# EAGLE design v02 (EAGLE 6.6.0)
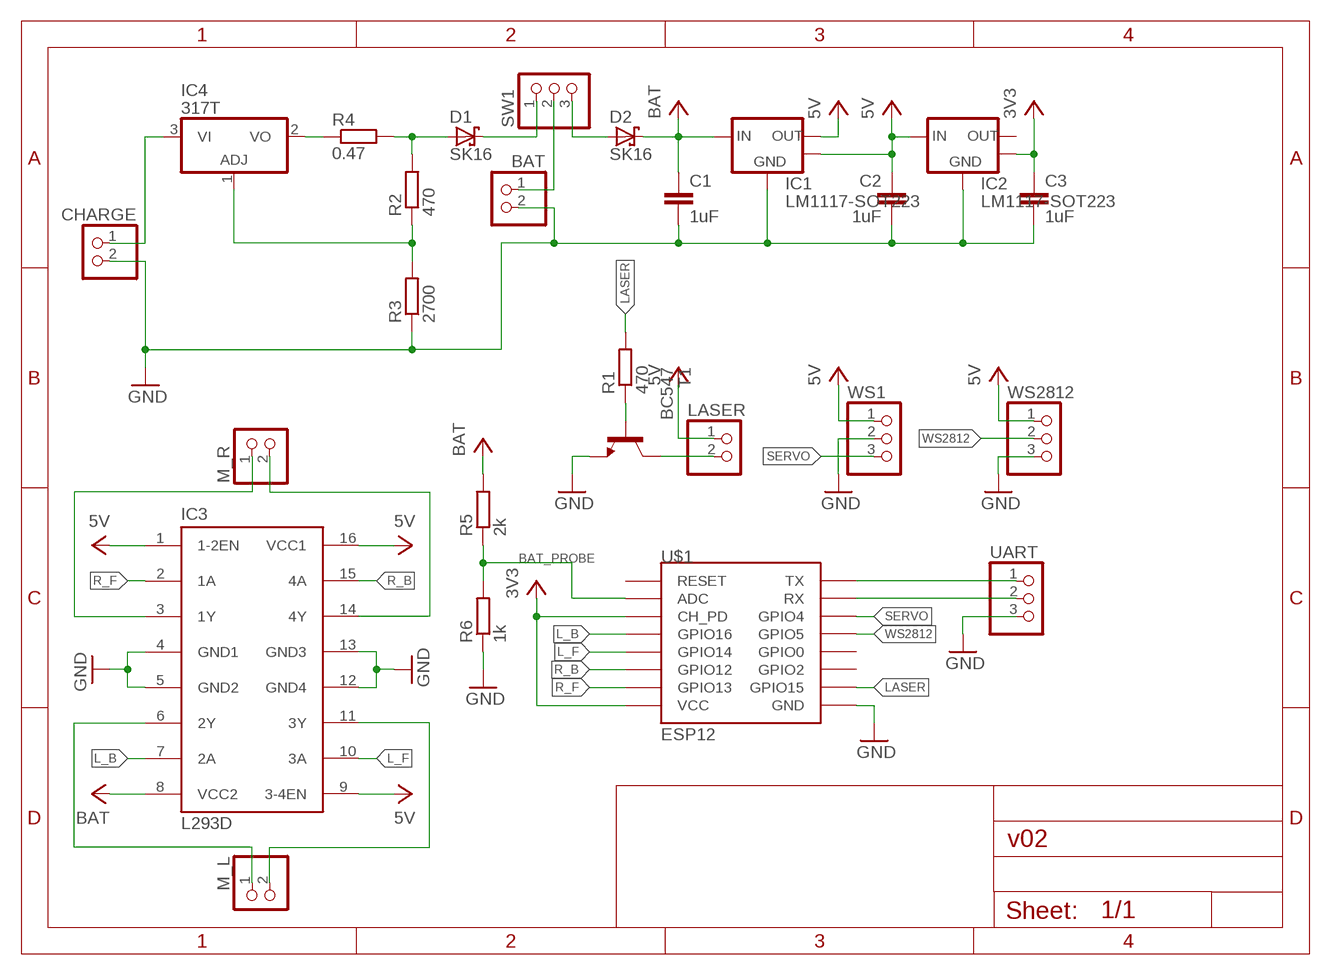
[diagram p0: schematic, sheet 1]

## Parts
BAT  PINHD-1X2  [1X02]
C1  1uF  C-EUC0805  [C0805]
C2  1uF  C-EUC0805  [C0805]
C3  1uF  C-EUC0805  [C0805]
CHARGE  PINHD-1X2  [1X02]
D1  SK16  SCHOTTKY-DIODESMD  [SMB]
D2  SK16  SCHOTTKY-DIODESMD  [SMB]
IC1  LM1117-SOT223  [SOT-223-3]
IC2  LM1117-SOT223  [SOT-223-3]
IC3  L293D  [DIL16]
IC4  317T  [TO220H]
LASER  PINHD-1X2  [1X02]
M_L  PINHD-1X2  [1X02]
M_R  PINHD-1X2  [1X02]
R1  470  R-EU_R0805  [R0805]
R2  470  R-EU_R0805  [R0805]
R3  2700  R-EU_R0805  [R0805]
R4  0.47  R-EU_MELF0207W  [MINI_MELF-0207W]
R5  2k  R-EU_R0805  [R0805]
R6  1k  R-EU_R0805  [R0805]
SW1  PINHD-1X3  [1X03]
T1  BC547  [TO92]
U$1  ESP12  [ESP12]
UART  PINHD-1X3  [1X03]
WS1  PINHD-1X3  [1X03]
WS2812  PINHD-1X3  [1X03]

## Nets
3V3: C3.1 IC2.4(HEATSINK) U$1.CH_PD U$1.VCC
5V: C2.1 IC1.4(HEATSINK) IC2.3(VIN) LASER.1 WS1.1 WS2812.1
5V_2: IC1.2(VOUT) IC3.1(1-2EN) IC3.9(3-4EN) IC3.16(VCC1) ; supply symbol labelled 5V
BAT: C1.1 D2.C IC1.3(VIN) IC3.8(VCC2) R5.2
BAT_PROBE: R5.1 R6.2 U$1.ADC
GND: BAT.2 C1.2 C2.2 C3.2 CHARGE.2 IC1.1(GND) IC2.1(GND) IC3.4(GND1) IC3.5(GND2) IC3.12(GND4) IC3.13(GND3) R3.1 R6.1 T1.1(E) U$1.GND UART.3 WS1.2 WS2812.3
L_B: IC3.7(2A) U$1.GPIO16
L_F: IC3.10(3A) U$1.GPIO14
LASER: R1.2 U$1.GPIO15
N$1: BAT.1 SW1.2
N$2: R1.1 T1.2(B)
N$3: CHARGE.1 IC4.3(VI)
N$4: D1.C SW1.1
N$5: IC3.3(1Y) M_R.1
N$6: IC3.14(4Y) M_R.2
N$7: IC3.6(2Y) M_L.1
N$8: IC3.11(3Y) M_L.2
N$9: U$1.TX UART.1
N$10: U$1.RX UART.2
N$11: LASER.2 T1.3(C)
N$12: D1.A R2.2 R4.2
N$13: IC4.1(ADJ) R2.1 R3.2
N$14: IC4.2(VO) R4.1
N$15: D2.A SW1.3
R_B: IC3.15(4A) U$1.GPIO12
R_F: IC3.2(1A) U$1.GPIO13
SERVO: U$1.GPIO4 WS1.3
WS2812: U$1.GPIO5 WS2812.2
Unconnected: IC2.2(VOUT) U$1.GPIO0 U$1.GPIO2 U$1.RESET

## Library data of the parts
BAT CHARGE LASER M_L M_R = pinhead:PINHD-1X2: PIN HEADER
C1-C3 = rcl:C-EU: CAPACITOR, European symbol
D1 D2 = diode:SCHOTTKY-DIODE: Schottky Diode
IC1 IC2 = voltage_regulator:LM1117: LDO Voltage Regulator NCP1117 series are low dropout positive voltage regulators that are capable of providing an output current that is in excess of 1.0 A with a maximum dropout voltage of 1.2 V at 800 mA over temperature. This series contains nine fixed output voltages of 1.5 V, 1.8 V, 1.9 V, 2.0 V, 2.5 V, 2.85 V, 3.3 V, 5.0 V, and 12 V that have no minimum load requirement to maintain regulation. Also included is an adjustable output version that can be programmed from 1.25 V to 18.8 V with two external resistors. datasheet.pdf <http://www.onsemi.com/pub_link/Collateral/NCP1117-D.PDF> LM1117-N is a series of low dropout voltage regulators of 1.2V at 800mA of load current. It has the same pin-out as Texas Instruments' industry standard LM317. The LM1117-N is available in an adjustable version, available in five fixed voltages, 1.8V, 2.5V, 2.85V, 3.3V, and 5V. The LM1117-N offers current limiting and thermal shutdown. Its circuit includes a zener trimmed to within ±1%. datasheet.pdf <http://www.ti.com/lit/ds/symlink/lm1117-n.pdf>
IC3 = st-microelectronics:L293D: PUSH-PULL 4 CHANNEL DRIVER; MPN: L293D; OC_FARNELL: 9589619; OC_NEWARK: 56P8249
IC4 = linear:*317: Positive VOLTAGE REGULATOR
R1-R3 R5 R6 = rcl:R-EU_: RESISTOR, European symbol
R4 = resistor:R-EU_: RESISTOR, European symbol
SW1 UART WS1 WS2812 = pinhead:PINHD-1X3: PIN HEADER
T1 = transistor:BC547: NPN TRANSISTOR
U$1 = esp8266modules:ESP12: ESP8266 Wifi module 12

## Board
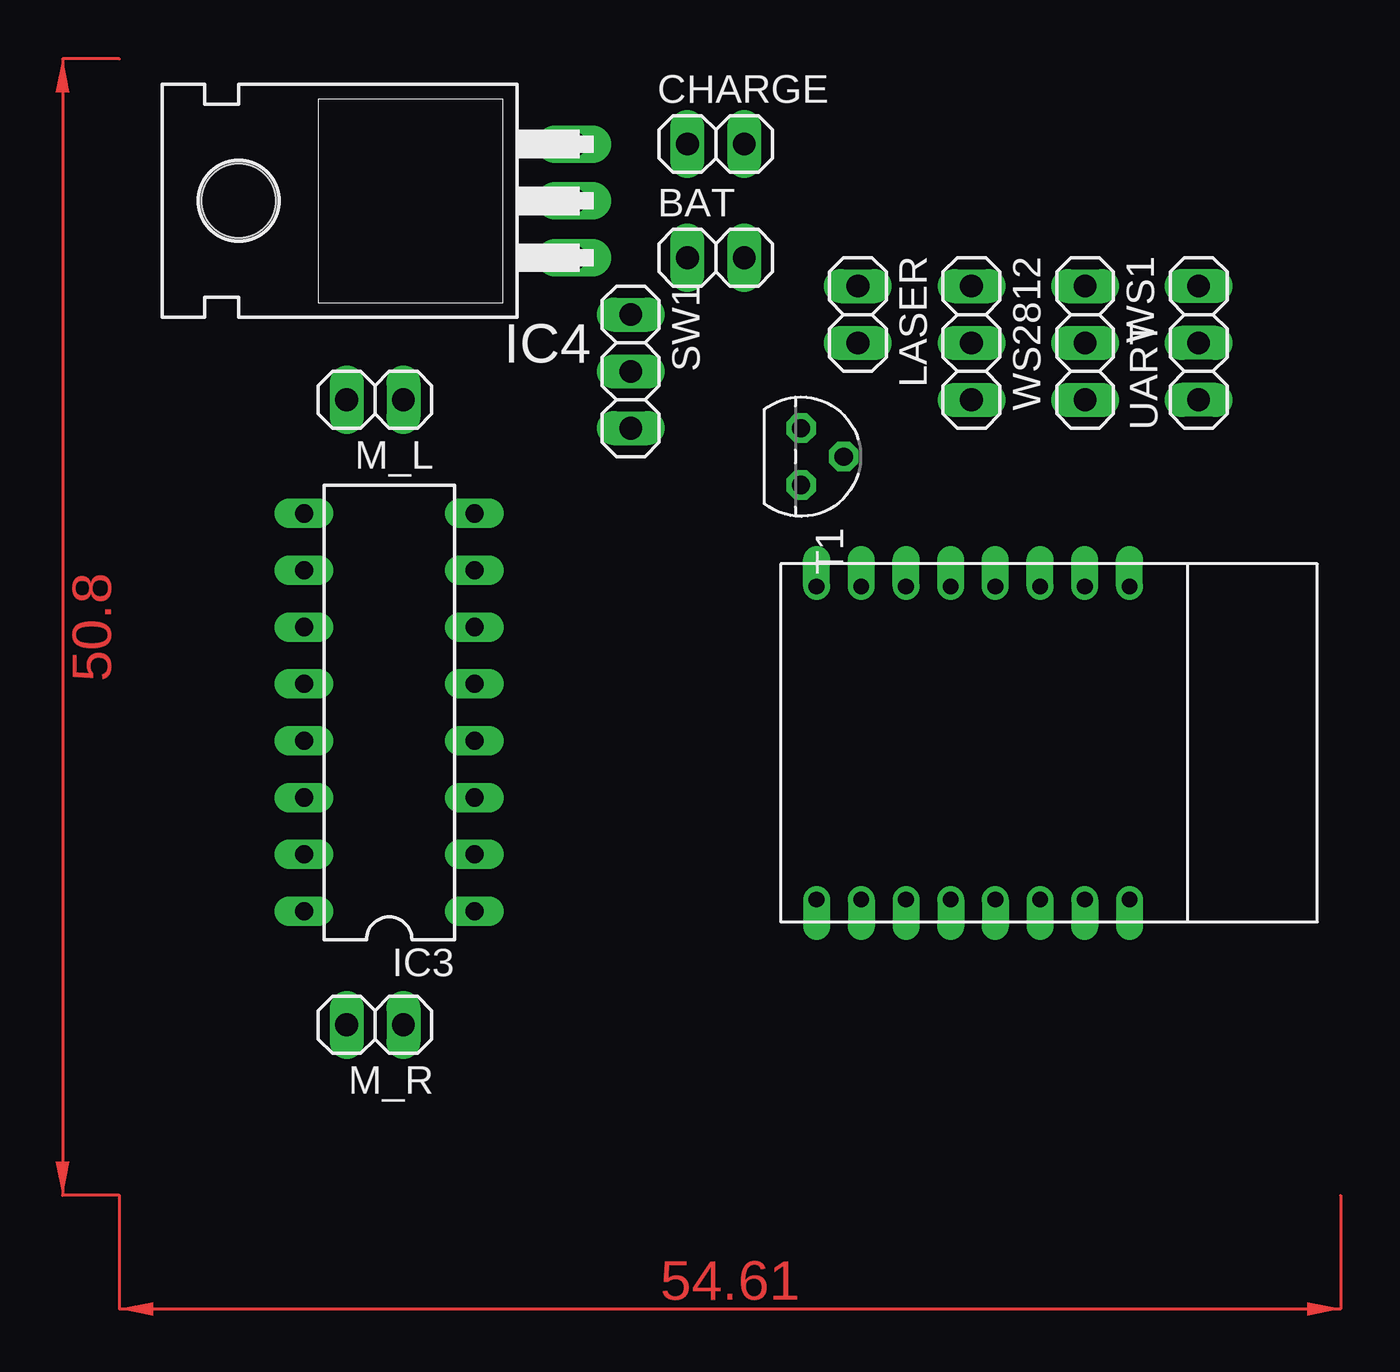
[diagram p1: board, top side]
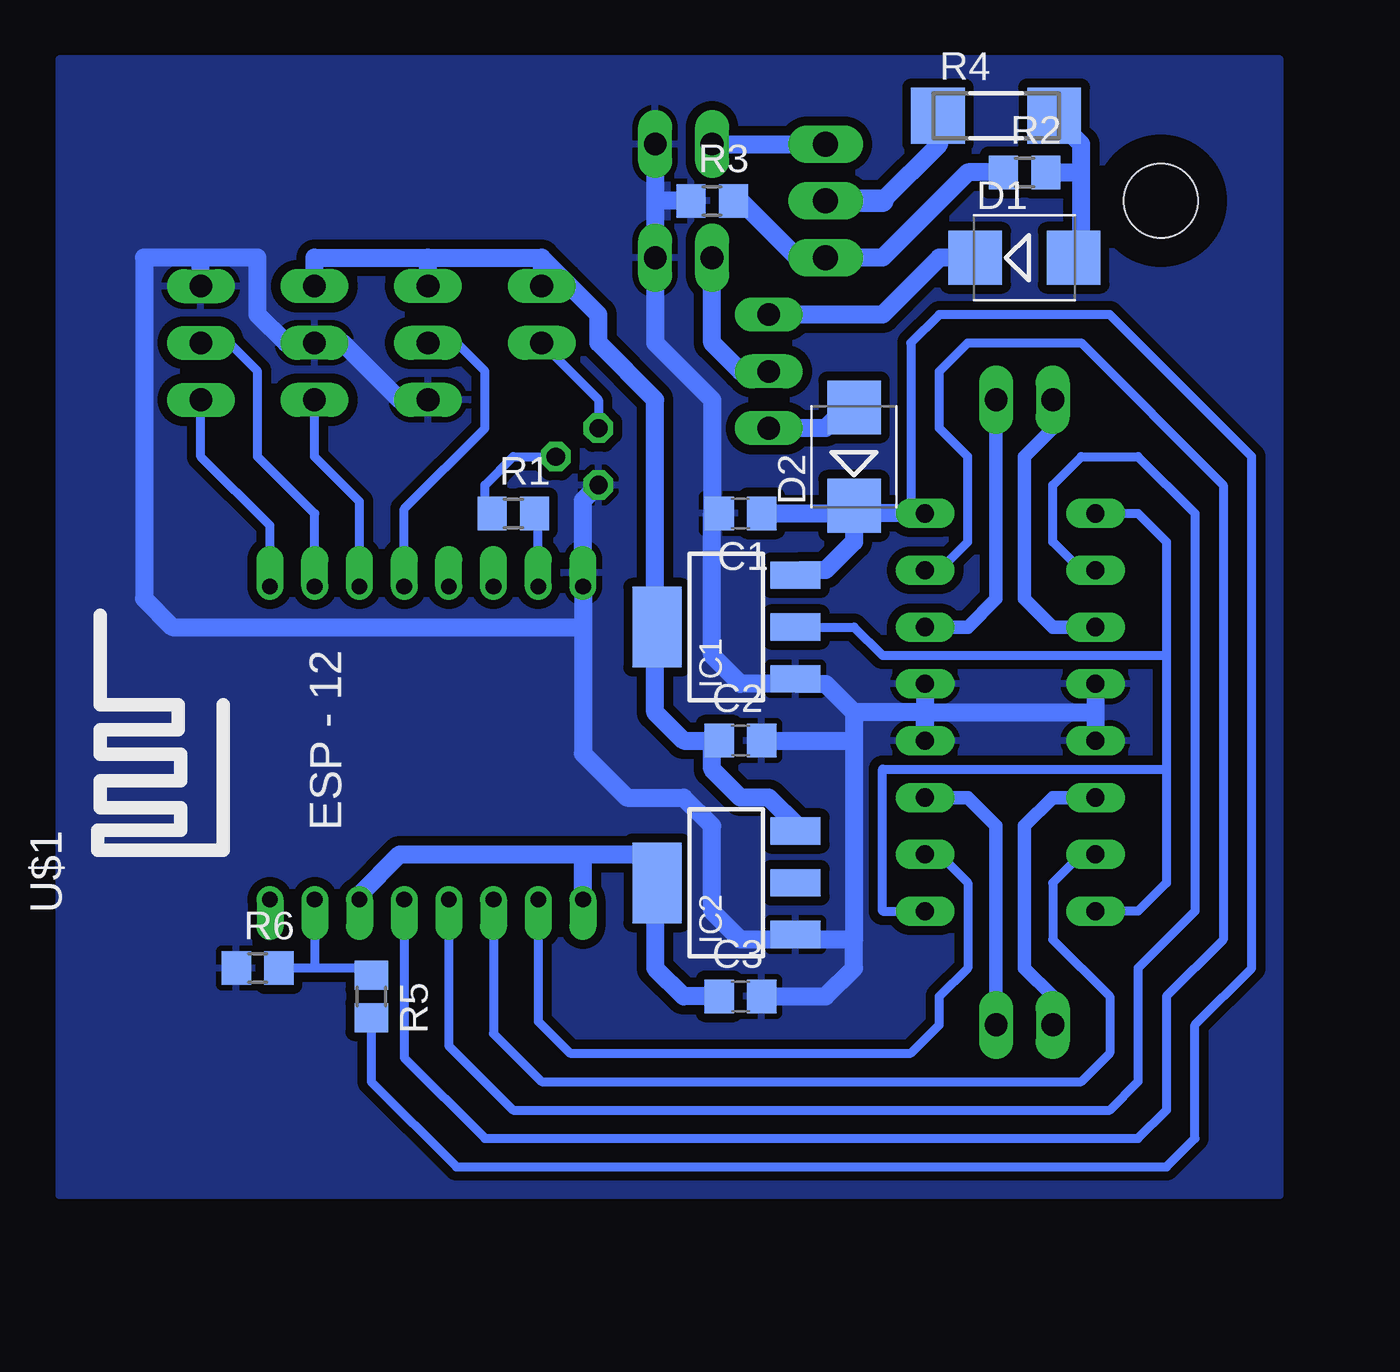
[diagram p2: board, bottom side, seen from below]

No outline drawn. Coordinates in mm, seen from the top.
Copper layers (1*16): Top 0.035mm / dielectric 1.5mm / Bottom 0.035mm
Design rules "default": minimum track width 10mil, minimum drill 24mil, track to track 8mil, track to pad 8mil, pad to pad 8mil, via to via 8mil, smd to smd 8mil, copper to edge 40mil, drill to drill 8mil, minimum pad ring 10mil, minimum via ring 8mil, stop-mask expansion 4mil, vias tented up to drill 0mil, thermal gap 10mil

### Footprints (pad centres in the part's own frame; a part is rotated, then mirrored left to right if it is on the bottom)
1X02 = drill 1.016 long: 1 -1.27,0; 2 1.27,0
C0805 = smd 1.3 x 1.5: 1 -0.95,0; 2 0.95,0
SMB = smd 2.4 x 2.4: A 2.2,0; C -2.2,0
SOT-223-3 = smd 1.219 x 2.235: 1 -2.311,-3.099; 2 0,-3.099; 3 2.311,-3.099 | smd 3.6 x 2.2: 4 0,3.099
DIL16 = drill 0.813 long: 1 -8.89,-3.81; 2 -6.35,-3.81; 3 -3.81,-3.81; 4 -1.27,-3.81; 5 1.27,-3.81; 6 3.81,-3.81; 7 6.35,-3.81; 8 8.89,-3.81; 9 8.89,3.81; 10 6.35,3.81; 11 3.81,3.81; 12 1.27,3.81; 13 -1.27,3.81; 14 -3.81,3.81; 15 -6.35,3.81; 16 -8.89,3.81
TO220H = drill 1.118 long: 1 -2.54,-10.16; 2 0,-10.16; 3 2.54,-10.16 | hole 3.302: 0,4.826
R0805 = smd 1.3 x 1.5: 1 -0.95,0; 2 0.95,0
MINI_MELF-0207W = smd 2.4 x 2.5: 1 -2.6,0; 2 2.6,0
1X03 = drill 1.016 long: 1 -2.54,0; 2 0,0; 3 2.54,0
TO92 = drill 0.813 octagon: 1 1.27,0; 2 0,1.905; 3 -1.27,0
ESP12 = drill 0.7 offset: ADC -7.1,3.8; CH_PD -7.1,1.8; GND 6.9,-8.2; GPIO0 6.9,-2.2; GPIO2 6.9,-4.2; GPIO4 6.9,1.8; GPIO5 6.9,-0.2; GPIO12 -7.1,-4.2; GPIO13 -7.1,-6.2; GPIO14 -7.1,-2.2; GPIO15 6.9,-6.2; GPIO16 -7.1,-0.2; RESET -7.1,5.8; RX 6.9,3.8; TX 6.9,5.8; VCC -7.1,-8.2

### Placement (x,y rotation side)
BAT  26.67,41.91 0 top
C1  24.13,30.48 180 bottom
C2  24.13,20.32 0 bottom
C3  24.13,8.89 0 bottom
CHARGE  26.67,46.99 0 top
D1  11.43,41.91 0 bottom
D2  19.05,33.02 90 bottom
IC1  24.77,25.4 90 bottom
IC2  24.77,13.97 90 bottom
IC3  12.06,21.59 90 top
IC4  10.16,44.45 90 top
LASER  33.02,39.37 270 top
M_L  11.43,35.56 180 top
M_R  11.43,7.62 180 top
R1  34.29,30.48 0 bottom
R2  11.43,45.72 0 bottom
R3  25.4,44.45 0 bottom
R4  12.7,48.26 0 bottom
R5  40.64,8.89 270 bottom
R6  45.72,10.16 0 bottom
SW1  22.86,36.83 270 top
T1  30.48,33.02 270 top
U$1  39.37,20.32 90 bottom
UART  48.26,38.1 90 top
WS1  43.18,38.1 270 top
WS2812  38.1,38.1 270 top

### Tracks (layer width: path | path; a pad name or v marks a point on that pad's centre or on a via)
3V3
  Bottom 0.813: IC2.4 27.94,13.97 | 27.94,13.97 27.94,10.16 26.67,8.89 C3.1 | 27.94,13.97 27.94,15.24 31.17,15.24 | U$1.VCC 31.17,15.24 | U$1.CH_PD 41.17,13.44 39.37,15.24 31.17,15.24
5V
  Bottom 0.813: 33.02,41.91 LASER.1 | WS1.1 43.18,41.91 38.1,41.91 | IC1.4 27.94,25.4 | IC2.3 21.67,16.43 21.59,16.51 22.86,17.78 24.13,17.78 25.4,19.05 25.4,20 C2.1 26.67,20.32 27.94,21.59 27.94,25.4 | WS2812.1 38.1,41.91 | 38.1,41.91 33.02,41.91 | 27.94,25.4 27.94,35.56 30.48,38.1 30.48,39.37 33.02,41.91
5V_2
  Bottom 0.406: IC3.9 6.35,30.48 5.08,29.21 5.08,24.13 | 5.08,24.13 5.08,19.05 | 5.08,19.05 5.08,13.97 6.35,12.7 IC3.16 | IC1.2 19.05,25.4 17.78,24.13 5.08,24.13 | 5.08,19.05 17.78,19.05 17.78,12.7 IC3.1
BAT
  Bottom 0.406: R5.2 40.64,5.08 36.83,1.27 5.08,1.27 3.81,2.54 3.81,7.62 1.27,10.16 1.27,33.02 7.62,39.37 15.24,39.37 16.51,38.1 16.51,30.48
  Bottom 0.813: IC3.8 16.51,30.48 19.05,30.48 | 19.05,30.48 19.05,29.21 20.32,27.94 21.44,27.94 IC1.3 | C1.1 19.05,30.48 | D2.C 19.05,30.48
BAT_PROBE
  Bottom 0.406: R5.1 40.64,10.16 43.18,10.16 | 43.18,10.16 R6.2 | U$1.ADC 43.17,10.17 43.18,10.16
GND
  Bottom 0.813: T1.1 31.17,31.06 U$1.GND 31.17,25.4 | IC3.12 8.26,21.59 | 8.26,21.59 IC3.13 | 25.4,30.48 25.4,35.56 27.94,38.1 BAT.2 27.94,44.45 | IC1.1 21.67,22.94 21.59,22.86 | 21.59,22.86 24.13,22.86 25.4,24.13 25.4,30.48 | 25.4,30.48 C1.2 | 21.59,22.86 20.32,22.86 19.05,21.59 | 19.05,21.59 19.05,20.32 | 19.05,20.32 19.05,11.43 | 19.05,11.43 21.59,11.43 | 21.59,11.43 21.59,11.58 IC2.1 | C2.2 19.05,20.32 | IC3.5 IC3.4 15.88,21.59 | 15.88,21.59 8.26,21.59 | WS2812.3 39.37,35.56 41.91,38.1 WS1.2 44.45,38.1 45.72,39.37 45.72,41.91 48.26,41.91 | 48.26,41.91 50.8,41.91 50.8,26.67 49.53,25.4 31.17,25.4 | 15.88,21.59 19.05,21.59 | 21.59,11.43 24.13,11.43 25.4,12.7 25.4,16.51 26.67,17.78 29.21,17.78 31.17,19.74 31.17,25.4 | C3.2 20.32,8.89 19.05,10.16 19.05,11.43 | CHARGE.2 27.94,44.45 | R3.1 27.94,44.45 | UART.3 48.26,41.91
  pour Bottom (isolate 0.406): 0,0 0,50.8 54.61,50.8 54.61,0
L_B
  Bottom 0.406: IC3.7 15.24,27.94 13.97,29.21 13.97,33.02 15.24,34.29 15.24,36.83 13.97,38.1 8.89,38.1 2.54,31.75 2.54,11.43 5.08,8.89 5.08,3.81 6.35,2.54 35.56,2.54 39.17,6.15 U$1.GPIO16
L_F
  Bottom 0.406: IC3.10 8.89,27.94 10.16,29.21 10.16,31.75 8.89,33.02 6.35,33.02 3.81,30.48 3.81,12.7 6.35,10.16 6.35,5.08 7.62,3.81 34.29,3.81 37.17,6.69 U$1.GPIO14
LASER
  Bottom 0.406: U$1.GPIO15 33.17,30.31 R1.2
N$1
  Bottom 0.813: SW1.2 24.13,36.83 25.4,38.1 BAT.1
N$2
  Bottom 0.406: R1.1 35.56,30.48 35.56,31.75 34.29,33.02 T1.2
N$3
  Bottom 0.813: CHARGE.1 IC4.3
N$4
  Bottom 0.813: D1.C 15.24,41.91 17.78,39.37 SW1.1
N$5
  Bottom 0.61: IC3.3 13.97,17.78 12.7,16.51 M_R.1
N$6
  Bottom 0.61: IC3.14 10.16,17.78 11.43,16.51 11.43,10.16 10.16,8.89 M_R.2
N$7
  Bottom 0.61: IC3.6 13.97,25.4 12.7,26.67 M_L.1
N$8
  Bottom 0.61: M_L.2 10.16,34.29 11.43,33.02 11.43,26.67 10.16,25.4 IC3.11
N$9
  Bottom 0.406: U$1.TX 45.17,29.93 48.26,33.02 UART.1
N$10
  Bottom 0.406: UART.2 46.99,38.1 45.72,36.83 45.72,33.02 43.17,30.47 U$1.RX
N$11
  Bottom 0.406: LASER.2 30.48,35.56 T1.3
N$12
  Bottom 0.813: D1.A 8.89,41.91 8.89,45.72 | 8.89,45.72 8.89,46.99 10.16,48.26 R4.2 | R2.2 8.89,45.72
N$13
  Bottom 0.813: R3.2 24.13,44.45 21.59,41.91 IC4.1 17.78,41.91 13.97,45.72 R2.1
N$14
  Bottom 0.813: 17.78,44.45 15.24,46.99 15.24,48.2 R4.1
  Bottom 1.016: 17.78,44.45 IC4.2
N$15
  Bottom 0.813: D2.A 19.39,35.22 20.32,34.29 SW1.3
R_B
  Bottom 0.406: IC3.15 8.89,15.24 10.16,13.97 10.16,11.43 7.62,8.89 7.62,6.35 8.89,5.08 33.02,5.08 35.17,7.23 U$1.GPIO12
R_F
  Bottom 0.406: IC3.2 15.24,15.24 13.97,13.97 13.97,10.16 15.24,8.89 15.24,7.62 16.51,6.35 31.75,6.35 33.17,7.77 U$1.GPIO13
SERVO
  Bottom 0.406: U$1.GPIO4 41.17,31.01 43.18,33.02 WS1.3
WS2812
  Bottom 0.406: WS2812.2 36.83,38.1 35.56,36.83 35.56,34.29 39.17,30.68 U$1.GPIO5
(copper drawn outside any net)
  shapes: Top area x2